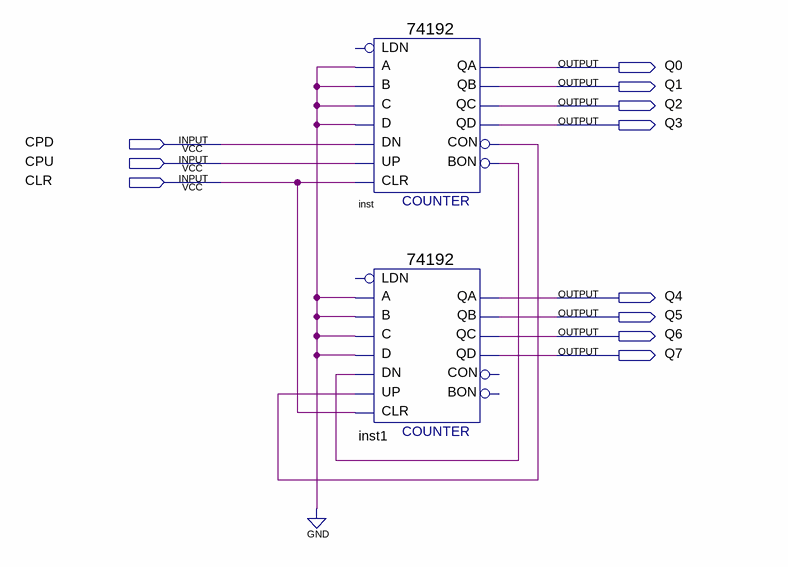
[diagram p0: schematic sheet]
// Quartus schematic Block1.bdf as structural Verilog: 2 symbols, 11 pins
module Block1 (
  input  CPD,
  input  CPU,
  input  CLR,
  output Q0,
  output Q1,
  output Q2,
  output Q3,
  output Q4,
  output Q5,
  output Q6,
  output Q7
);

  wire inst_bon, inst_con;

  \74192  inst (
    .D(1'b0), .C(1'b0), .A(1'b0), .B(1'b0), .CLR(CLR), .UP(CPU), .DN(CPD), .QB(Q1), .BON(inst_bon),
    .CON(inst_con), .QA(Q0), .QC(Q2), .QD(Q3));  // open: LDN
  \74192  inst1 (
    .D(1'b0), .C(1'b0), .A(1'b0), .B(1'b0), .CLR(CLR), .UP(inst_con), .DN(inst_bon), .QB(Q5), .QA(Q4),
    .QC(Q6), .QD(Q7));  // open: LDN, BON, CON
endmodule
